# EAGLE schematic collpitss (EAGLE 7.6.0)
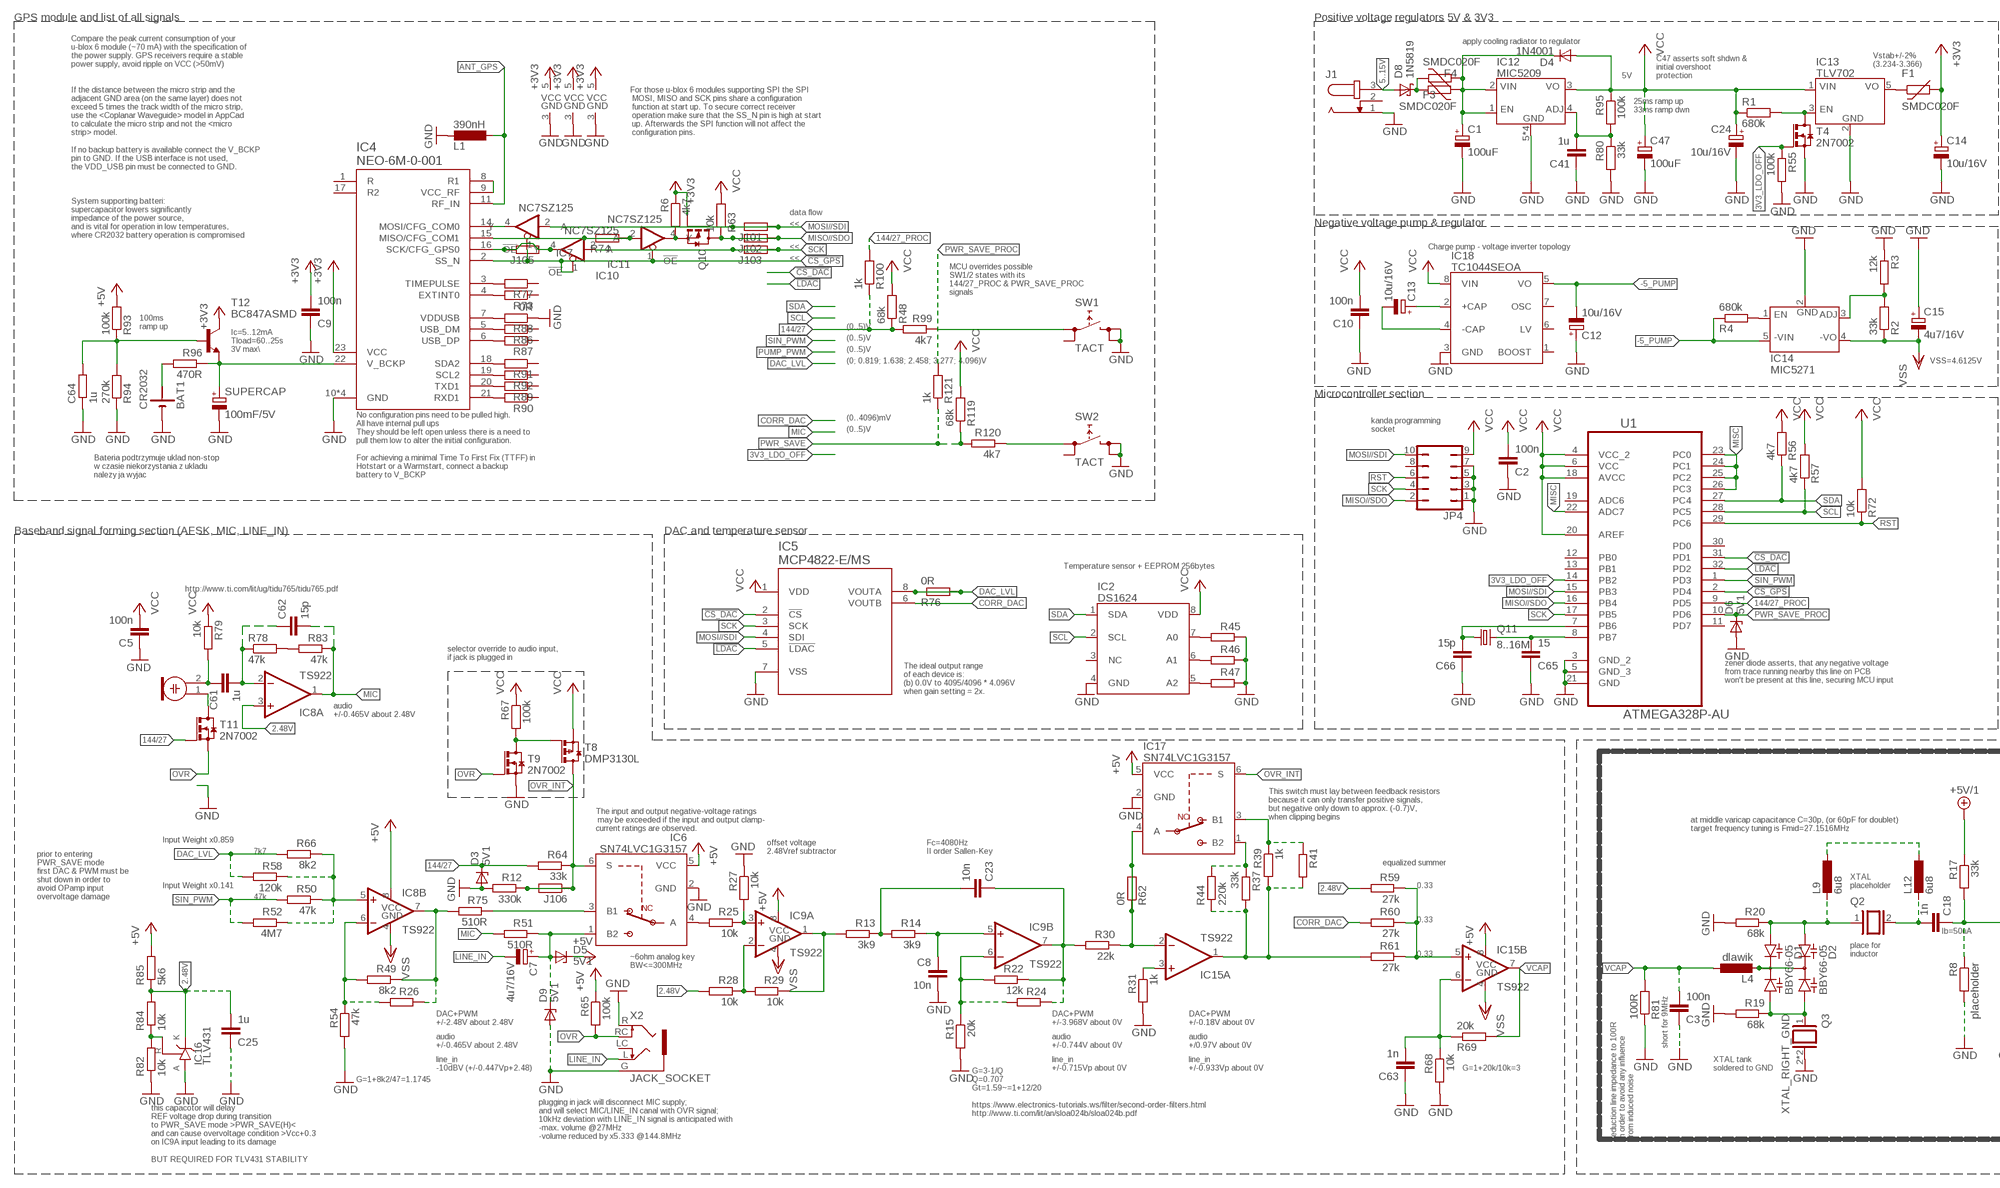
[diagram p0: schematic, sheet 1, part 1 of 2]
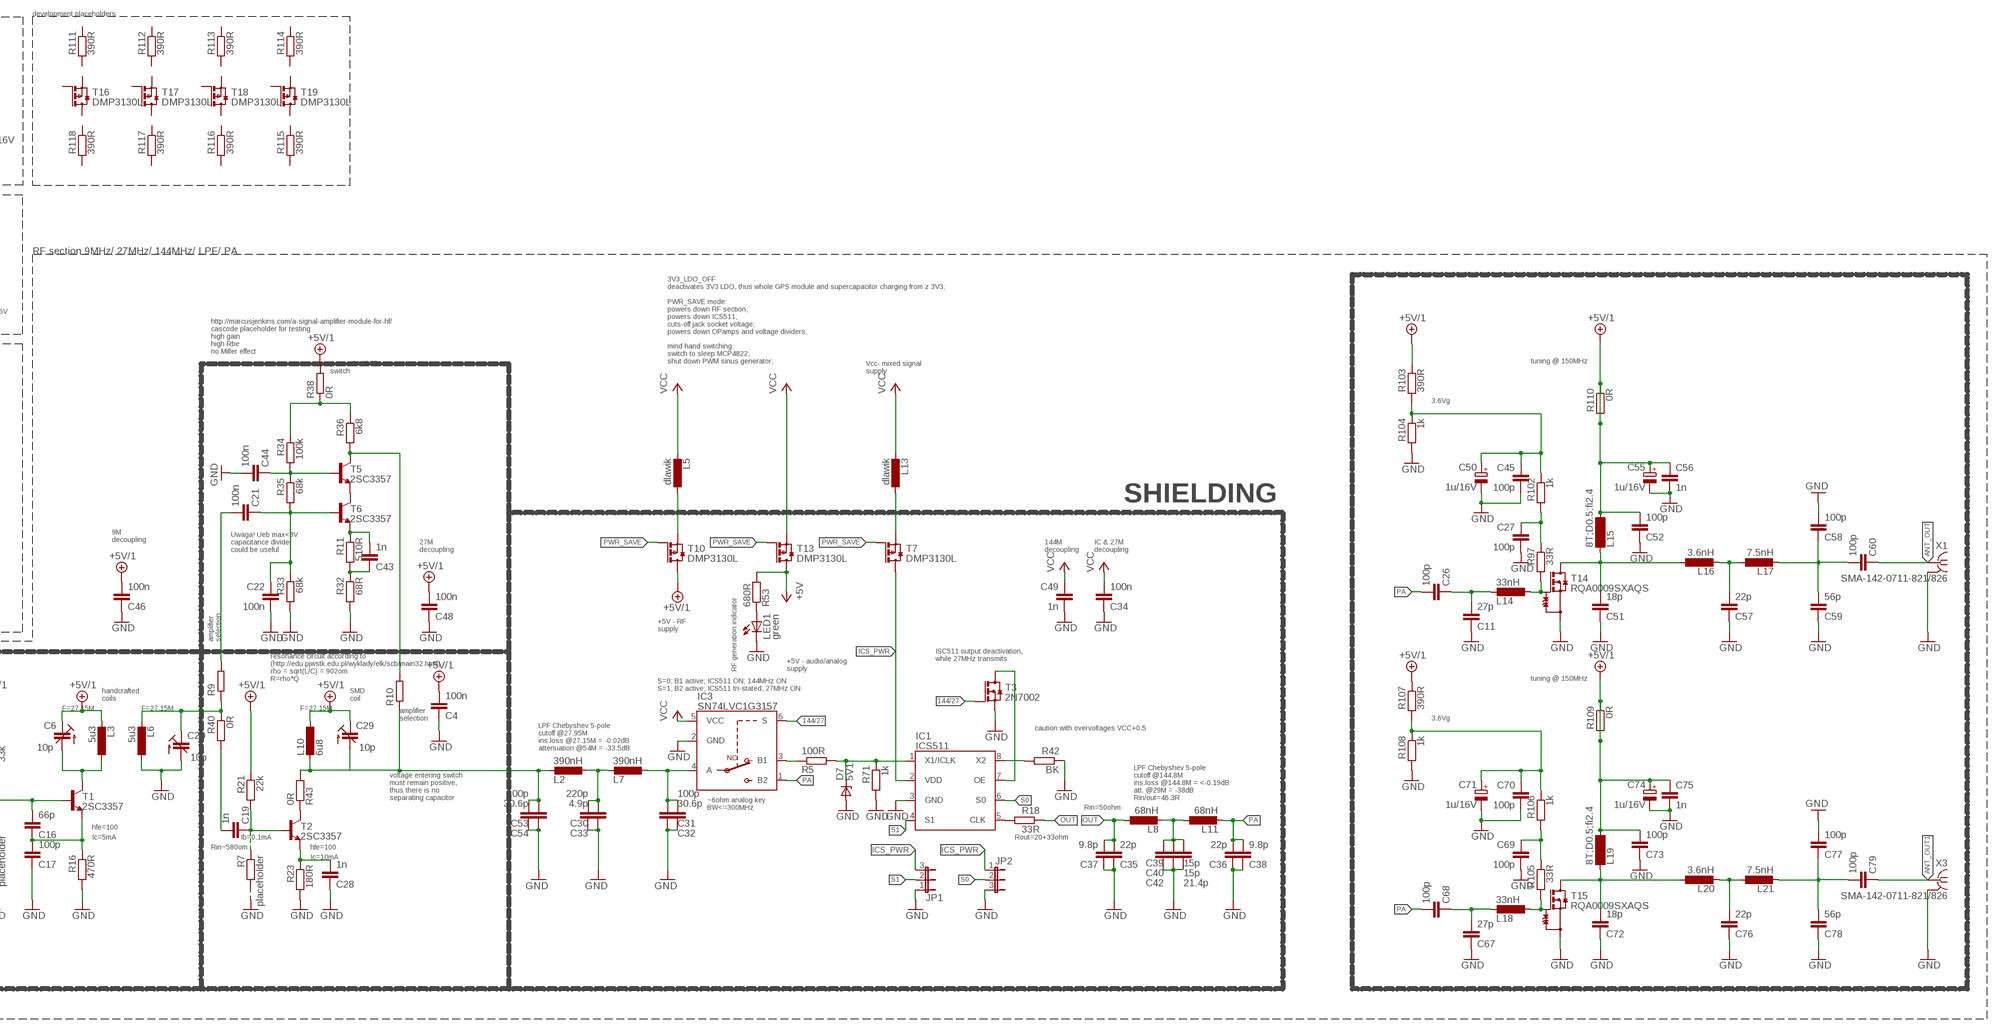
[diagram p1: schematic, sheet 1, part 2 of 2]

## Parts
BAT1  CR2032  [CR2032_HOLDER]
C1  100uF  CPOL-EU153CLV-0605  [153CLV-0605]
C2  100n  C-EUC0805  [C0805]
C3  100n  C-EUC0805  [C0805]
C4  100n  C-EUC0805  [C0805]
C5  100n  C-EUC0805  [C0805]
C6  10p  C_TRIMM  [TZC3_SERIES]
C7  4u7/16V  TANTAL_POLY"3218"  [TANTAL"3216"]
C8  10n  C-EUC0805  [C0805]
C9  100n  C-EUC0805  [C0805]
C10  100n  C-EUC0805  [C0805]
C11  27p  C-EUC0805  [C0805]
C12  10u/16V  TANTAL_POLY"3218"  [TANTAL"3216"]
C13  10u/16V  TANTAL_POLY"3218"  [TANTAL"3216"]
C14  10u/16V  TANTAL_POLY"3218"  [TANTAL"3216"]
C15  4u7/16V  TANTAL_POLY"3218"  [TANTAL"3216"]
C16  66p  C-EUC0805  [C0805]
C17  100p  C-EUC0805  [C0805]
C18  1n  C-EUC0603K  [C0603K]
C19  1n  C-EUC0603K  [C0603K]
C20  10p  C_TRIMM  [TZC3_SERIES]
C21  100n  C-EUC0805  [C0805]
C22  100n  C-EUC0805  [C0805]
C23  10n  C-EUC0805  [C0805]
C24  10u/16V  TANTAL_POLY"3218"  [TANTAL"3216"]
C25  1u  C-EUC1206  [C1206]
C26  100p  C-EUC0805  [C0805]
C27  100p  C-EUC0805  [C0805]
C28  1n  C-EUC0603K  [C0603K]
C29  10p  C_TRIMM  [TZC3_SERIES]
C30  220p  C-EUC0805  [C0805]
C31  100p  C-EUC0805  [C0805]
C32  30.6p  C-EUC0805  [C0805]
C33  4.9p  C-EUC0805  [C0805]
C34  100n  C-EUC0805  [C0805]
C35  22p  C-EUC0805  [C0805]
C36  22p  C-EUC0805  [C0805]
C37  9.8p  C-EUC0805  [C0805]
C38  9.8p  C-EUC0805  [C0805]
C39  15p  C-EUC0805  [C0805]
C40  21.4p  C-EUC0805  [C0805]
C41  1u  C-EUC1206  [C1206]
C42  15p  C-EUC0805  [C0805]
C43  1n  C-EUC0603K  [C0603K]
C44  100n  C-EUC0805  [C0805]
C45  100p  C-EUC0805  [C0805]
C46  100n  C-EUC0805  [C0805]
C47  100uF  CPOL-EU153CLV-0605  [153CLV-0605]
C48  100n  C-EUC0805  [C0805]
C49  1n  C-EUC0603K  [C0603K]
C50  1u/16V  TANTAL_POLY"3218"  [TANTAL"3216"]
C51  18p  C-EUC0805  [C0805]
C52  100p  C-EUC0805  [C0805]
C53  100p  C-EUC0805  [C0805]
C54  30.6p  C-EUC0805  [C0805]
C55  1u/16V  TANTAL_POLY"3218"  [TANTAL"3216"]
C56  1n  C-EUC0603K  [C0603K]
C57  22p  C-EUC0805  [C0805]
C58  100p  C-EUC0805  [C0805]
C59  56p  C-EUC0805  [C0805]
C60  100p  C-EUC0805  [C0805]
C61  1u  ZWORA_C  [ZWORA]
C62  15p  C-EUC0805  [C0805]
C63  1n  C-EUC0603K  [C0603K]
C64  1u  ZWORA  [ZWORA]
C65  15  C-EUC0805  [C0805]
C66  15p  C-EUC0805  [C0805]
C67  27p  C-EUC0805  [C0805]
C68  100p  C-EUC0805  [C0805]
C69  100p  C-EUC0805  [C0805]
C70  100p  C-EUC0805  [C0805]
C71  1u/16V  TANTAL_POLY"3218"  [TANTAL"3216"]
C72  18p  C-EUC0805  [C0805]
C73  100p  C-EUC0805  [C0805]
C74  1u/16V  TANTAL_POLY"3218"  [TANTAL"3216"]
C75  1n  C-EUC0603K  [C0603K]
C76  22p  C-EUC0805  [C0805]
C77  100p  C-EUC0805  [C0805]
C78  56p  C-EUC0805  [C0805]
C79  100p  C-EUC0805  [C0805]
D1  BBY66-05  [SOT23-3]
D2  BBY66-05  [SOT23-3]
D3  5V1  1N4148  [SOD323]
D4  1N4001  [DO-214AC]
D5  5V1  1N4148  [SOD323]
D6  5V1  1N4148  [SOD323]
D7  5V1  1N4148  [SOD323]
D8  1N5819  [DO-214AC]
D9  5V1  1N4148  [SOD323]
F1  SMDC020F  [1812]
F3  SMDC020F  [1812]
F4  SMDC020F  [1812]
IC1  ICS511  [SOIC8]
IC2  DS1624  [SOIC8]
IC3  SN74LVC1G3157  [SC70-6]
IC4  NEO-6M-0-001  [NEO-6M-0-001]
IC5  MCP4822-E/MS  [SOP65P490X110-8N]
IC6  SN74LVC1G3157  [SC70-6]
IC7  NC7SZ125  [SC70-5]
IC8  TS922  [SO08]
IC9  TS922  [SO08]
IC10  NC7SZ125  [SC70-5]
IC11  NC7SZ125  [SC70-5]
IC12  MIC5209  [SOIC8]
IC13  TLV702  [SOT23-5]
IC14  MIC5271  [SOT23-5]
IC15  TS922  [SO08]
IC16  TLV431  TL431-ASA  [SOT23-3]
IC17  SN74LVC1G3157  [SC70-6]
IC18  TC1044SEOA  [SOIC8]
J1  JACK-PLUG1  [SPC4078]
J101  ZWORA  [ZWORA]
J102  ZWORA  [ZWORA]
J103  ZWORA  [ZWORA]
J105  ZWORA  [ZWORA]
J106  ZWORA  [ZWORA]
JP1  JP2E  [JP2]
JP2  JP2E  [JP2]
JP4  JP5Q  [JP5Q]
L1  390nH  0603K_INDUCTOR  [0603K]
L2  390nH  0603K_INDUCTOR  [0603K]
L3  5u3  L-EUL1812  [L1812]
L4  dlawik  0806_INDUCTOR  [0806]
L5  dlawik  0806_INDUCTOR  [0806]
L6  5u3  L-EUL1812  [L1812]
L7  390nH  0603K_INDUCTOR  [0603K]
L8  68nH  0805_INDUCTOR  [0805]
L9  6u8  1812_INDUCTOR  [1812]
L10  6u8  1812_INDUCTOR  [1812]
L11  68nH  0805_INDUCTOR  [0805]
L12  6u8  1812_INDUCTOR  [1812]
L13  dlawik  0806_INDUCTOR  [0806]
L14  33nH  0603K_INDUCTOR  [0603K]
L15  8T;D0.5;fi2.4  SM-Z15  [SM-Z15]
L16  3.6nH  0805_INDUCTOR  [0805]
L17  7.5nH  0805_INDUCTOR  [0805]
L18  33nH  0603K_INDUCTOR  [0603K]
L19  8T;D0.5;fi2.4  SM-Z15  [SM-Z15]
L20  3.6nH  0805_INDUCTOR  [0805]
L21  7.5nH  0805_INDUCTOR  [0805]
LED1  green  LEDCHIP-LED0805  [CHIP-LED0805]
M1  ELECTRET_MICROPHON-WM-61A  [WM-61A]
Q2  XTAL"  [Q"]
Q3  XTAL_RIGHT_GND  [Q]
Q10  AO3402  [SOT23-3]
Q11  8..16M  CRYSTALSM49  [SM49]
R1  680k  ZWORA  [ZWORA]
R2  33k  R-EU_R0805  [R0805]
R3  12k  R-EU_R0805  [R0805]
R4  680k  R-EU_R0805  [R0805]
R5  100R  R-EU_R0805  [R0805]
R6  4k7  R-EU_R0805  [R0805]
R7  placeholder  R-EU_R0805  [R0805]
R8  placeholder  R-EU_R0805  [R0805]
R9  ZWORA  [ZWORA]
R10  ZWORA  [ZWORA]
R11  510R  R-EU_R0805  [R0805]
R12  330k  R-EU_R0805  [R0805]
R13  3k9  R-EU_R0805  [R0805]
R14  3k9  R-EU_R0805  [R0805]
R15  20k  R-EU_R0805  [R0805]
R16  470R  R-EU_R0805  [R0805]
R17  33k  R-EU_R0805  [R0805]
R18  33R  R-EU_R0805  [R0805]
R19  68k  R-EU_R0805  [R0805]
R20  68k  R-EU_R0805  [R0805]
R21  22k  R-EU_R0805  [R0805]
R22  12k  R-EU_R0805  [R0805]
R23  180R  R-EU_R0805  [R0805]
R24  R-EU_R0805  [R0805]
R25  10k  R-EU_R0805  [R0805]
R26  R-EU_R0805  [R0805]
R27  10k  R-EU_R0805  [R0805]
R28  10k  R-EU_R0805  [R0805]
R29  10k  R-EU_R0805  [R0805]
R30  22k  R-EU_R0805  [R0805]
R31  1k  R-EU_R0805  [R0805]
R32  68R  ZWORA  [ZWORA]
R33  68k  R-EU_R0805  [R0805]
R34  100k  R-EU_R0805  [R0805]
R35  68k  R-EU_R0805  [R0805]
R36  6k8  R-EU_R0805  [R0805]
R37  33k  R-EU_R0805  [R0805]
R38  0R  R-EU_R1206  [R1206]
R39  1k  R-EU_R0805  [R0805]
R40  0R  R-EU_R1206  [R1206]
R41  R-EU_R0805  [R0805]
R42  BK  R-EU_R0805  [R0805]
R43  0R  R-EU_R1206  [R1206]
R44  220k  R-EU_R0805  [R0805]
R45  R-EU_R0805  [R0805]
R46  R-EU_R0805  [R0805]
R47  R-EU_R0805  [R0805]
R48  68k  R-EU_R0805  [R0805]
R49  8k2  R-EU_R0805  [R0805]
R50  47k  R-EU_R0805  [R0805]
R51  510R  R-EU_R0805  [R0805]
R52  4M7  R-EU_R0805  [R0805]
R53  680R  ZWORA  [ZWORA]
R54  47k  R-EU_R0805  [R0805]
R55  100k  R-EU_R0805  [R0805]
R56  4k7  R-EU_R0805  [R0805]
R57  4k7  ZWORA  [ZWORA]
R58  120k  R-EU_R0805  [R0805]
R59  27k  R-EU_R0805  [R0805]
R60  27k  R-EU_R0805  [R0805]
R61  27k  R-EU_R0805  [R0805]
R62  0R  ZWORA  [ZWORA]
R63  10k  R-EU_R0805  [R0805]
R64  33k  R-EU_R0805  [R0805]
R65  100k  ZWORA  [ZWORA]
R66  8k2  R-EU_R0805  [R0805]
R67  100k  R-EU_R0805  [R0805]
R68  10k  R-EU_R0805  [R0805]
R69  20k  R-EU_R0805  [R0805]
R71  1k  R-EU_R0805  [R0805]
R72  10k  R-EU_R0805  [R0805]
R73  R-EU_R0805  [R0805]
R74  ZWORA  [ZWORA]
R75  510R  R-EU_R0805  [R0805]
R76  0R  ZWORA  [ZWORA]
R77  R-EU_R0805  [R0805]
R78  47k  R-EU_R0805  [R0805]
R79  10k  R-EU_R0805  [R0805]
R80  33k  R-EU_R0805  [R0805]
R81  100R  R-EU_R0805  [R0805]
R82  10k  R-EU_R0805  [R0805]
R83  47k  R-EU_R0805  [R0805]
R84  10k  R-EU_R0805  [R0805]
R85  5k6  R-EU_R0805  [R0805]
R86  R-EU_R0805  [R0805]
R87  R-EU_R0805  [R0805]
R88  0R  R-EU_R0805  [R0805]
R89  R-EU_R0805  [R0805]
R90  R-EU_R0805  [R0805]
R91  R-EU_R0805  [R0805]
R92  R-EU_R0805  [R0805]
R93  100k  R-EU_R0805  [R0805]
R94  270k  ZWORA  [ZWORA]
R95  100k  R-EU_R0805  [R0805]
R96  470R  ZWORA  [ZWORA]
R97  33R  R-EU_R0805  [R0805]
R99  4k7  R-EU_R0805  [R0805]
R100  1k  R-EU_R0805  [R0805]
R102  1k  R-EU_R0805  [R0805]
R103  390R  R-EU_R0805  [R0805]
R104  1k  R-EU_R0805  [R0805]
R105  33R  R-EU_R0805  [R0805]
R106  1k  R-EU_R0805  [R0805]
R107  390R  R-EU_R0805  [R0805]
R108  1k  R-EU_R0805  [R0805]
R109  0R  ZWORA  [ZWORA]
R110  0R  ZWORA  [ZWORA]
R111  390R  R-EU_R0805  [R0805]
R112  390R  R-EU_R0805  [R0805]
R113  390R  R-EU_R0805  [R0805]
R114  390R  R-EU_R0805  [R0805]
R115  390R  R-EU_R0805  [R0805]
R116  390R  R-EU_R0805  [R0805]
R117  390R  R-EU_R0805  [R0805]
R118  390R  R-EU_R0805  [R0805]
R119  68k  R-EU_R0805  [R0805]
R120  4k7  R-EU_R0805  [R0805]
R121  1k  ZWORA  [ZWORA]
SUPERCAP  100mF/5V  CPOL-EUUD-10X10  [UD-10X10_NICHICON]
SW1  TACT  [TACT]
SW2  TACT  [TACT]
T1  2SC3357  [SOT-89-BCE]
T2  2SC3357  [SOT-89-BCE]
T3  2N7002  [SOT23-3W]
T4  2N7002  [SOT23-3W]
T5  2SC3357  [SOT-89-BCE]
T6  2SC3357  [SOT-89-BCE]
T7  DMP3130L  [SOT23-3]
T8  DMP3130L  [SOT23-3]
T9  2N7002  [SOT23-3W]
T10  DMP3130L  [SOT23-3]
T11  2N7002  [SOT23-3W]
T12  BC847ASMD  [SOT23]
T13  DMP3130L  [SOT23-3]
T14  RQA0009SXAQS  [SOT-89-GSD]
T15  RQA0009SXAQS  [SOT-89-GSD]
T16  DMP3130L  [SOT23-3]
T17  DMP3130L  [SOT23-3]
T18  DMP3130L  [SOT23-3]
T19  DMP3130L  [SOT23-3]
U1  ATMEGA328P-AU  [QFP80P900X900X120-32N]
X1  SMA-142-0711-821/826  [J502-ND-142-0711-821/826]
X2  JACK_SOCKET  [JACK_SOCKET]
X3  SMA-142-0711-821/826  [J502-ND-142-0711-821/826]

## Nets
2.48V: C25.2 IC8.3(A:+IN) IC16.2(K) R28.2 R59.2 R84.2 R85.1
3V3_LDO_OFF: R55.1 T4.1(G) U1.14(PB2)
5..15V: D8.A J1.3
144/27: D3.C(K) IC3.6(S) R48.1 R64.2 R99.2 R100.1 T3.1(G) T11.1(G)
144/27_PROC: R100.2 U1.9(PD5)
!CS_DAC!: IC5.2(!CS!) U1.31(PD1)
!CS_GPS!: IC4.2(SS_N) IC7.1(!OE!) IC10.1(!OE!) IC11.1(!OE!) U1.2(PD4)
!LDAC!: IC5.5(!LDAC!) U1.32(PD2)
+3V3: C9.2 C14.+ F1.P$2 IC4.23(VCC) IC7.5(VCC) IC10.5(VCC) IC11.5(VCC) Q10.1(G) R6.1 T12.3(C)
+5V: D5.C(K) IC6.5(VCC) IC8.8(C:VCC) IC9.8(C:VCC) IC15.8(C:VCC) IC17.5(VCC) R53.2 R65.1 R85.2 R93.2 T13.3(D)
+5V/1: C4.2 C6.2(E) C29.2(E) C46.2 C48.2 C52.2 C55.+ C56.1 C73.2 C74.+ C75.1 L3.2 L10.1 L15.2 L19.2 R17.1 R21.1 R38.2 R103.1 R107.1 R109.1 R109.2 R110.1 R110.2 T10.3(D)
-5_PUMP: C12.- IC14.5(-VIN) IC18.5(VO) R4.1
ANT_GPS: IC4.11(RF_IN) L1.1
ANT_OUT: C60.1 X1.1
ANT_OUT1: C79.1 X3.1
ASASA: D8.C(K) F3.P$1 F4.P$2
CAS_IN: C20.2(E) L6.2 R9.1 R40.1
CORR_DAC: IC5.6(VOUTB) R60.2
DAC_LVL: IC5.8(VOUTA) R58.2 R66.2 R76.1 R76.2
GND: BAT1.- C1.- C2.1 C3.1 C4.1 C5.1 C8.2 C9.1 C10.1 C11.1 C12.+ C14.- C15.+ C17.1 C20.1(A) C22.2 C24.- C25.1 C27.2 C28.1 C30.1 C31.1 C32.1 C33.1 C34.1 C35.1 C36.1 C37.1 C38.1 C39.1 C40.1 C41.1 C42.1 C44.2 C45.2 C46.1 C47.- C48.1 C49.2 C50.- C51.1 C52.1 C53.1 C54.1 C55.- C56.2 C57.1 C58.2 C59.1 C63.1 C64.1 C65.1 C66.1 C67.1 C69.2 C70.2 C71.- C72.1 C73.1 C74.- C75.2 C76.1 C77.2 C78.1 D3.A D6.A D7.A D9.A IC1.3(GND) IC2.4(GND) IC3.2(GND) IC4.10(GND) IC4.12(GND) IC4.13(GND) IC4.24(GND) IC5.7(VSS) IC6.2(GND) IC7.3(GND) IC10.3(GND) IC11.3(GND) IC12.5(GND) IC12.6(GND) IC12.7(GND) IC12.8(GND) IC13.2(GND) IC14.2(GND) IC16.3(A) IC17.2(GND) IC18.3(GND) J1.1 JP1.1 JP2.3 JP4.1 JP4.3 JP4.5 JP4.7 L1.2 L6.1 LED1.C Q3.2 Q3.P$1 R3.1 R7.2 R8.2 R12.2 R15.2 R16.2 R19.2 R20.2 R23.2 R27.1 R31.2 R32.2 R33.2 R42.1 R45.1 R46.1 R47.1 R54.2 R55.2 R68.2 R71.2 R80.2 R81.1 R82.1 R88.1 R94.1 R104.2 R108.2 SUPERCAP.- SW1.2 SW1.3 SW2.2 SW2.3 T3.2(S) T4.2(S) T9.2(S) T14.2(S) T14.2@1(S) T15.2(S) T15.2@1(S) U1.3(GND_2) U1.5(GND_3) U1.21(GND) X1.G@1 X1.G@2 X1.G@3 X1.G@4 X2.G(GND) X2.R X3.G@1 X3.G@2 X3.G@3 X3.G@4
ICS_PWR: IC1.2(VDD) JP1.3 JP2.1 T7.3(D)
J104: IC4.15(MISO/CFG_COM1) IC11.2(A) R74.1 R74.2
LINE_IN: C7.- X2.L
LOLOLO: IC13.3(EN) R1.2 T4.3(D)
MIC: C62.2 IC8.1(A:OUT) R51.2 R83.1
MISC: U1.22(ADC7) U1.23(PC0) U1.24(PC1) U1.25(PC2) U1.26(PC3)
MISO//SDO: J102.1 J102.2 JP4.2 Q10.3(D) R63.1 U1.16(PB4)
MOSI//SDI: IC5.4(SDI) IC7.2(A) J101.1 J101.2 JP4.10 U1.15(PB3)
N$1: C31.2 C32.2 IC3.4(A) L7.1
N$2: D1.3(K) D2.3(K) L4.2
N$3: C1.+ D4.C(K) F3.P$2 F4.P$1 IC12.1(EN) IC12.2(VIN)
N$4: F1.P$1 IC13.5(VO)
N$5: BAT1.+ R96.2
N$6: IC14.3(ADJ) R2.2 R3.2
N$7: C6.1(A) L3.1 T1.C T1.C@1(C)
N$8: IC3.3(B1) R5.1
N$9: L5.1 T10.2(S)
N$10: IC1.7(OE) T3.3(D)
N$11: IC14.1(EN) R4.2
N$12: C23.2 R13.1 R14.2
N$13: D1.2(A2) D2.2(A2) Q3.1 R19.1
N$14: IC11.4(Y) Q10.2(S) R6.2
N$15: D1.1(A1) D2.1(A1) L9.2 Q2.1 R20.1
N$16: C18.2 L12.2 Q2.2
N$17: L9.1 L12.1
N$19: C16.2 C18.1 R8.1 R17.2 T1.B
N$20: C29.1(A) C53.2 C54.2 L2.2 L10.2 R10.1 R43.2
N$21: C23.1 IC9.7(B:OUT) R22.1 R24.1 R30.2
N$22: C8.1 IC9.5(B:+IN) R14.1
N$23: IC9.6(B:-IN) R15.1 R22.2 R24.2
N$24: C28.2 R23.1 T2.E
N$25: IC6.4(A) R25.2
N$26: C19.1 R7.1 R21.2 T2.B
N$27: IC9.3(A:+IN) R25.1 R27.2
N$28: IC9.2(A:-IN) R28.1 R29.2
N$29: IC15.3(A:+IN) R31.1
N$30: IC9.1(A:OUT) R13.2 R29.1
N$31: IC17.3(B1) R39.1 R41.1
N$32: IC15.1(A:OUT) R37.2 R39.2 R41.2 R44.1 R61.2
N$33: C16.1 C17.2 R16.1 T1.E
N$34: IC17.1(B2) R37.1 R44.2
N$35: R99.1 SW1.1
N$36: L13.1 T7.2(S)
N$37: IC15.2(A:-IN) IC17.4(A) R30.1 R62.1 R62.2
N$38: C13.+ IC18.2(+CAP)
N$39: C11.2 C26.1 L14.2
N$40: C13.- IC18.4(-CAP)
N$41: C27.1 R97.1 R102.2
N$42: C21.2 R9.2
N$43: C67.2 C68.1 L18.2
N$44: L18.1 R105.2 T15.1(G)
N$45: L14.1 R97.2 T14.1(G)
N$46: C51.2 L15.1 L16.1 T14.3(D)
N$47: C57.2 L16.2 L17.1
N$48: C69.1 R105.1 R106.2
N$49: T5.E T6.C T6.C@1(C)
N$50: C43.2 R11.1 T6.E
N$51: C43.1 R11.2 R32.1
N$52: C44.1 R34.2 R35.1 T5.B
N$53: C39.2 C40.2 C42.2 L8.2 L11.1
N$54: C58.1 C59.2 C60.2 L17.2
N$55: C19.2 R40.2
N$56: C21.1 C22.1 R33.1 R35.2 T6.B
N$57: R10.2 R36.2 T5.C T5.C@1(C)
N$58: R34.1 R36.1 R38.1
N$59: IC1.5(CLK) R18.2
N$60: R43.1 T2.C T2.C@1(C)
N$61: IC1.8(X2) R42.2
N$62: C72.2 L19.1 L20.1 T15.3(D)
N$63: C41.2 IC12.4(ADJ) R80.1 R95.2
N$64: R67.2 T8.1(G) T9.3(D)
N$65: C45.1 C50.+ R102.1 R103.2 R104.1
N$66: IC2.7(A0) R45.2
N$67: IC2.6(A1) R46.2
N$68: IC2.5(A2) R47.2
N$69: C76.2 L20.2 L21.1
N$70: IC8.7(B:OUT) R26.1 R49.1 R75.2
N$71: C7.+ D5.A D9.C(K) IC6.1(B2) R51.1
N$72: D7.C(K) IC1.1(X1/ICLK) R5.2 R71.1
N$73: C77.1 C78.2 C79.2 L21.2
N$74: C30.2 C33.2 L2.1 L7.2
N$75: C70.1 C71.+ R106.1 R107.2 R108.1
N$76: IC8.5(B:+IN) R50.1 R52.1 R58.1 R66.1
N$79: R120.1 SW2.1
N$80: IC4.22(V_BCKP) R96.1 SUPERCAP.+ T12.2(E)
N$83: IC4.4(EXTINT0) R73.2
N$85: C63.2 IC15.6(B:-IN) R68.1 R69.1
N$87: IC15.5(B:+IN) R59.1 R60.1 R61.1
N$88: IC4.3(TIMEPULSE) R77.2
N$89: C61.1 M1.2 R79.2
N$90: IC6.3(B1) R75.1
N$91: R78.2 R83.2
N$92: IC4.14(MOSI/CFG_COM0) IC7.4(Y)
N$93: IC4.16(SCK/CFG_GPS0) IC10.4(Y) J105.1 J105.2
N$95: C61.2 C62.1 IC8.2(A:-IN) R78.1
N$96: LED1.A R53.1
N$97: IC8.6(B:-IN) R26.2 R49.2 R54.1
N$98: IC16.1(R) R82.2 R84.1
N$99: IC4.5(USB_DM) R86.2
N$100: IC4.6(USB_DP) R87.2
N$101: IC4.7(VDDUSB) R88.2
N$102: IC4.20(TXD1) R89.2
N$103: IC4.21(RXD1) R90.2
N$104: IC4.18(SDA2) R91.2
N$105: IC4.19(SCL2) R92.2
N$107: IC4.8(R1) IC4.9(VCC_RF)
N$108: C65.2 Q11.2 U1.8(PB7)
N$109: C64.2 R93.1 R94.2 T12.1(B)
N$113: C66.2 Q11.1 U1.7(PB6)
N$114: M1.1 T11.3(D)
OUT: C35.2 C37.2 L8.1 R18.1
OVR: R65.2 T9.1(G) T11.2(S) X2.RC
OVR_INT: IC6.6(S) IC17.6(S) J106.1 J106.2 R12.1 R64.1 T8.3(D)
PA: C26.2 C36.2 C38.2 C68.2 IC3.1(B2) L11.2
PWR_SAVE: R119.1 R120.2 R121.1 T7.1(G) T10.1(G) T13.1(G)
PWR_SAVE_PROC: D6.C(K) R121.2 U1.10(PD6)
RST: JP4.6 R72.1 U1.29(PC6)
S0: IC1.6(S0) JP2.2
S1: IC1.4(S1) JP1.2
SCK: IC5.3(SCK) IC10.2(A) J103.1 J103.2 JP4.4 U1.17(PB5)
SCL: IC2.2(SCL) R57.1 U1.28(PC5)
SDA: IC2.1(SDA) R56.1 U1.27(PC4)
SIN_PWM: R50.2 R52.2 U1.1(PD3)
VCAP: C3.2 IC15.7(B:OUT) L4.1 R69.2 R81.2
VCC: C2.2 C5.2 C10.2 C24.+ C34.2 C47.+ C49.1 D4.A IC2.8(VDD) IC3.5(VCC) IC5.1(VDD) IC12.3(VO) IC13.1(VIN) IC18.8(VIN) JP4.9 L5.2 L13.2 R1.1 R48.2 R56.2 R57.2 R63.2 R67.1 R72.2 R79.1 R95.1 R119.2 T8.2(S) T13.2(S) U1.4(VCC_2) U1.6(VCC) U1.18(AVCC) U1.20(AREF)
VSS: C15.- IC8.4(C:GND) IC9.4(C:GND) IC14.4(-VO) IC15.4(C:GND) R2.1
Unconnected: IC2.3(NC) IC4.1(R) IC4.17(R2) IC18.1(BOOST) IC18.6(LV) IC18.7(OSC) J1.2 JP4.8 R73.1 R77.1 R86.1 R87.1 R89.1 R90.1 R91.1 R92.1 R111.1 R111.2 R112.1 R112.2 R113.1 R113.2 R114.1 R114.2 R115.1 R115.2 R116.1 R116.2 R117.1 R117.2 R118.1 R118.2 SW1.4 SW2.4 T16.1(G) T16.2(S) T16.3(D) T17.1(G) T17.2(S) T17.3(D) T18.1(G) T18.2(S) T18.3(D) T19.1(G) T19.2(S) T19.3(D) U1.11(PD7) U1.12(PB0) U1.13(PB1) U1.19(ADC6) U1.30(PD0) X2.LC

## Notes on the sheet
- GPS module and list of all signals | Positive voltage regulators 5V & 3V3 | development placeholders
- apply cooling radiator to regulator
- Compare the peak current consumption of your 
  u-blox 6 module (~70 mA) with the specification of
  the power supply. GPS receivers require a stable
  power supply, avoid ripple on VCC (>50mV)
- Vstab+/-2%
  (3.234-3.366)
- 5V
- C47 asserts soft shdwn &
  initial overshoot
  protection
- 25ms ramp up
  33ms ramp dwn
- If the distance between the micro strip and the
  adjacent GND area (on the same layer) does not
  exceed 5 times the track width of the micro strip,
  use the <Coplanar Waveguide> model in AppCad
  to calculate the micro strip and not the <micro
  strip> model.
- For those u-blox 6 modules supporting SPI the SPI
   MOSI, MISO and SCK pins share a configuration
   function at start up. To secure correct receiver
   operation make sure that the SS_N pin is high at start
   up. Afterwards the SPI function will not affect the
   configuration pins.
- If no backup battery is available connect the V_BCKP
  pin to GND. If the USB interface is not used, 
  the VDD_USB pin must be connected to GND.
- data flow
- << | Negative voltage pump & regulator
- System supporting batteri:
  supercapacitor lowers significantly 
  impedance of the power source, 
  and is vital for operation in low temperatures, 
  where CR2032 battery operation is compromised
- << | Charge pump - voltage inverter topology
- <<
- MCU overrides possible 
  SW1/2 states with its
  144/27_PROC & PWR_SAVE_PROC
  signals
- RF section 9MHz/ 27MHz/ 144MHz/ LPF/ PA
- 100ms 
  ramp up
- (0..5)V
- (0..5)V
- Ic=5..12mA
  Tload=60..25s
  3V max\
- (0..5)V
- (0; 0.819; 1.638; 2.458; 3.277; 4.096)V | VSS=4.6125V
- Microcontroller section
- http://marcusjenkins.com/a-signal-amplifier-module-for-hf/
  cascode placeholder for testing
  high gain
  high Rbe
  no Miller effect
- (0..4096)mV
- 3V3_LDO_OFF
  deactivates 3V3 LDO, thus whole GPS module and supercapacitor charging from z 3V3;
  
  PWR_SAVE mode:
  powers down RF section;
  powers down ICS511;
  cuts-off jack socket voltage;
  powers down OPamps and voltage dividers;
  
  mind hand switching:
  switch to sleep MCP4822;
  shut down PWM sinus generator;
- tuning @ 150MHz
- (0..5)V
- kanda programming
  socket
- power ON/OFF
  switch
- Vcc- mixed signal 
  supply
- No configuration pins need to be pulled high. 
  All have internal pull ups
  They should be left open unless there is a need to 
  pull them low to alter the initial configuration.
- 3.6Vg
- Bateria podtrzymuje uklad non-stop
  w czasie niekorzystania z ukladu
  nalezy ja wyjac
- For achieving a minimal Time To First Fix (TTFF) in
  Hotstart or a Warmstart, connect a backup
  battery to V_BCKP
- Baseband signal forming section (AFSK, MIC, LINE_IN) | DAC and temperature sensor
- Temperature sensor + EEPROM 256bytes
- SHIELDING
- http://www.ti.com/lit/ug/tidu765/tidu765.pdf
- 9M
  decoupling
- Uwaga! Ueb max<3V
  capacitance divider
  could be useful
- 27M
  decoupling
- 144M 
  decoupling
- IC & 27M
  decoupling
- selector override to audio input,
  if jack is plugged in
- zener diode asserts, that any negative voltage
  from trace running nearby this line on PCB
  won't be present at this line, securing MCU input
- The ideal output range 
  of each device is:
  (b) 0.0V to 4095/4096 * 4.096V 
  when gain setting = 2x.
- audio
  +/-0.465V about 2.48V
- +5V - RF 
  supply
- amplifier
  selection
- ISC511 output deactivation,
  while 27MHz transmits
- RF generation indicator
- +5V - audio/analog 
  supply
- resonance circuit according to
  (http://edu.pjwstk.edu.pl/wyklady/elk/scb/main32.html)
  rho = sqrt(L/C) = 902om
  R=rho*Q
- tuning @ 150MHz
- S=0; B1 active; ICS511 ON; 144MHz ON
  S=1; B2 active; ICS511 tri-stated; 27MHz ON
- handcrafted
  coils
- SMD
  coil
- This switch must lay between feedback resistors
  because it can only transfer positive signals,
  but negative only down to approx. (-0.7)V,
  when clipping begins
- F=27.15M | F=27.15M | F=27.15M
- The input and output negative-voltage ratings
   may be exceeded if the input and output clamp-
  current ratings are observed.
- at middle varicap capacitance C=30p, (or 60pF for doublet)
  target frequency tuning is Fmid=27.1516MHz
- amplifier
  selection
- 3.6Vg
- Input Weight x0.859 | caution with overvoltages VCC+0.5
- 7k7
- offset voltage 
  2.48Vref subtractor
- Fc=4080Hz
  II order Sallen-Key
- equalized summer
- LPF Chebyshev 5-pole
  cutoff @27.95M 
  ins.loss @27.15M = -0.02dB
  attenuation @54M = -33.5dB
- Input Weight x0.141 | 0.33
- XTAL
  placeholder
- prior to entering
  PWR_SAVE mode
  first DAC & PWM must be
  shut down in order to
  avoid OPamp input 
  overvoltage damage
- 47k
- 0.33
- voltage entering switch 
  must remain positive,
  thus there is no 
  separating capacitor
- LPF Chebyshev 5-pole
  cutoff @144.8M
  ins.loss @144.8M = <-0.19dB
  att. @29M = -38dB
  Rin/out=46.3R
- Ib=50uA
- ~6ohm analog key 
  BW<=300MHz
- Rin=50ohm
- 0.33
- place for 
  inductor
- hfe=100
- ~6ohm analog key 
  BW<=300MHz
- Ic=5mA | Ib=0.1mA | Rout=20+33ohm
- Rin~580om | hfe=100
- Ic=10mA
- DAC+PWM
  +/-2.48V about 2.48V
- DAC+PWM
  +/-3.968V about 0V
- DAC+PWM
  +/-0.18V about 0V
- audio
  +/-0.465V about 2.48V
- audio
  +/-0.744V about 0V
- audio
  +/0.97V about 0V
- short for 9MHz
- line_in
  -10dBV (+/-0.447Vp+2.48)
- line_in
  +/-0.715Vp about 0V
- line_in
  +/-0.933Vp about 0V
- G=1+20k/10k=3
- XTAL tank
  soldered to GND
- G=1+8k2/47=1.1745
- G=3-1/Q
  Q=0.707
  Gt=1.59~=1+12/20
  
  https://www.electronics-tutorials.ws/filter/second-order-filters.html
  http://www.ti.com/lit/an/sloa024b/sloa024b.pdf
- plugging in jack will disconnect MIC supply;
  and will select MIC/LINE_IN canal with OVR signal;
  10kHz deviation with LINE_IN signal is anticipated with
  -max. volume @27MHz
  -volume reduced by x5.333 @144.8MHz
- reduction line impedance to 100R
  in order to avoid any influence
  from induced noise
- this capacotor will delay
  REF voltage drop during transition
  to PWR_SAVE mode >PWR_SAVE(H)<
  and can cause overvoltage condition >Vcc+0.3
  on IC9A input leading to its damage
  
  BUT REQUIRED FOR TLV431 STABILITY

## Library data of the parts
BAT1 = TI:CR2032: CR2032 +3V springy button battery holder
C1 C47 SUPERCAP = rcl:CPOL-EU: POLARIZED CAPACITOR, European symbol
C2-C5 C8-C11 C16-C19 C21-C23 C25-C28 C30-C46 C48 C49 C51-C54 C56-C60 C62 C63 C65-C70 C72 C73 C75-C79 = rcl:C-EU: CAPACITOR, European symbol
C6 C20 C29 = TI:C_TRIMM: MuRata capacitor trimmer 3-20pF
C7 C12-C15 C24 C50 C55 C71 C74 = TI:TANTAL_POLY"3218": Yellow aliexpress tantal/polymer capacitor 4u7/16V; 10u/16V
C61 = freescale_sensors:ZWORA_C
C64 J101-J103 J105 J106 R1 R9 R10 R32 R53 R57 R62 R65 R74 R76 R94 R96 R109 R110 R121 = freescale_sensors:ZWORA: ZWORKA SMD
D1 D2 = TI:BBY66-05: Silicon Tuning Diodes • High capacitance ratio • High Q hyperabrupt tuning diode • Low series resistance • Designed for low tuning voltage operation for VCO's in mobile communications equipment • Very low capacitance spread
D3 D5-D7 D9 = TI:1N4148
D4 = TI:1N4001: M2 // rectifier diode Vblock = 50V
D8 = TI:1N5819: schottky diode SMD
F1 F3 F4 = PolyFuse:SMDC020F: Polymeric Positive Coefficient Thermistor (PolyFuse) 0.2A / 30V
IC1 = TI:ICS511: The ICS511 LOCOTM is the most cost effective way to generate a high quality, high frequency clock output from a lower frequency crystal or clock input.
IC2 = TI:DS1624: Digital Thermometer and 256 bytes E2 Memory
IC3 IC6 IC17 = TI:SN74LVC1G3157: Single-Pole Double-Throw Analog Switch
IC4 = TI:NEO-6M-0-001: The u-blox 6 leadless chip carrier (LCC) modules are standalone GPS and GPS/GLONASS/QZSS1 modules featuring the high performance u-blox-6 positioning engine.
IC5 = Microchip_By_element14_Batch_1:MCP4822-E/MS: Digital-to-Analog Converter; MPN: MCP4822-E/MS; OC_FARNELL: 1840942; OC_NEWARK: 31K2973; PACKAGE: SOP-8; SUPPLIER: Microchip
IC7 IC10 IC11 = TI:NC7SZ125: 3-state non inverting buffer
IC8 IC9 IC15 = linear:TS922: TS922 and TS922A devices are rail-to-rail dual BiCMOS operational amplifiers optimized and fully specified for 3 V and 5 V operation. These devices have high output currents which allow low-load impedances to be driven. Very low noise, low distortion
IC12 = TI:MIC5209: MIC5209 Microchip extremely LDO 300mA linear regulator
IC13 = TI:TLV702: TLV701-3V3 is a LDO 3V3 linear voltage regulator 320mA 250mV drop
IC14 = TI:MIC5271: Negative voltage LDO regulator with adjustable voltage 600mV drop @ 100mA output; -15Vmax at input
IC16 = TI:TL431-ASA: Reference voltage source with ultra low current (100uA) Vref=1.24 typ.
IC18 = TI:TC1044SEOA: Charge pump DC-DC converter, doubler, inverter 20mA, 1.5-12Vin
J1 = con-jack:JACK-PLUG: DC POWER JACK Power Jack, DC, Right Angle, Through Hole, Rated 5A at 16VDC, PC Terminals Distributor: Farnell (www.Farnell.de) Drawing: 84N1161.pdf / 84N1162.pdf Manufacturer: SPC Technology (www.spctechnology.com) Type: SPC4077 / SPC 4078; OC_FARNELL: unknown; OC_NEWARK: unknown
JP1 JP2 = jumper:JP2E: JUMPER
JP4 = jumper:JP5Q: JUMPER
L1 L2 L7 L14 L18 = TI:0603K_INDUCTOR
L3 L6 = rcl:L-EU: INDUCTOR, European symbol
L4 L5 L13 = TI:0806_INDUCTOR
L8 L11 L16 L17 L20 L21 = TI:0805_INDUCTOR
L9 L10 L12 = TI:1812_INDUCTOR
L15 L19 = inductor-neosid:SM-Z15: INDUCTOR SMD rod core choke; OC_FARNELL: unknown; OC_NEWARK: unknown
LED1 = led:LED: LED OSRAM: - CHIPLED LG R971, LG N971, LY N971, LG Q971, LY Q971, LO R971, LY R971 LH N974, LH R974 LS Q976, LO Q976, LY Q976 LO Q996 - Hyper CHIPLED LW Q18S LB Q993, LB Q99A, LB R99A - SideLED LS A670, LO A670, LY A670, LG A670, LP A670 LB A673, LV A673, LT A673, LW A673 LH A674 LY A675 LS A676, LA A676, LO A676, LY A676, LW A676 LS A679, LY A679, LG A679 - Hyper Micro SIDELED® LS Y876, LA Y876, LO Y876, LY Y876 LT Y87S - SmartLED LW L88C, LW L88S LB L89C, LB L89S, LG L890 LS L89K, LO L89K, LY L89K LS L896, LA L896, LO L896, LY L896 - TOPLED LS T670, LO T670, LY T670, LG T670, LP T670 LSG T670, LSP T670, LSY T670, LOP T670, LYG T670 LG T671, LOG T671, LSG T671 LB T673, LV T673, LT T673, LW T673 LH T674 LS T676, LA T676, LO T676, LY T676, LB T676, LH T676, LSB T676, LW T676 LB T67C, LV T67C, LT T67C, LS T67K, LO T67K, LY T67K, LW E67C LS E67B, LA E67B, LO E67B, LY E67B, LB E67C, LV E67C, LT E67C LW T67C LS T679, LY T679, LG T679 LS T770, LO T770, LY T770, LG T770, LP T770 LB T773, LV T773, LT T773, LW T773 LH T774 LS E675, LA E675, LY E675, LS T675 LS T776, LA T776, LO T776, LY T776, LB T776 LHGB T686 LT T68C, LB T68C - Hyper Mini TOPLED® LB M676 - Mini TOPLED Santana® LG M470 LS M47K, LO M47K, LY M47K Source: http://www.osram.convergy.de LUXEON: - LUMILED® LXK2-PW12-R00, LXK2-PW12-S00, LXK2-PW14-U00, LXK2-PW14-V00 LXK2-PM12-R00, LXK2-PM12-S00, LXK2-PM14-U00 LXK2-PE12-Q00, LXK2-PE12-R00, LXK2-PE12-S00, LXK2-PE14-T00, LXK2-PE14-U00 LXK2-PB12-K00, LXK2-PB12-L00, LXK2-PB12-M00, LXK2-PB14-N00, LXK2-PB14-P00, LXK2-PB14-Q00 LXK2-PR12-L00, LXK2-PR12-M00, LXK2-PR14-Q00, LXK2-PR14-R00 LXK2-PD12-Q00, LXK2-PD12-R00, LXK2-PD12-S00 LXK2-PH12-R00, LXK2-PH12-S00 LXK2-PL12-P00, LXK2-PL12-Q00, LXK2-PL12-R00 Source: www.luxeon.com KINGBRIGHT: KA-3528ASYC Source: www.kingbright.com
M1 = microphon:ELECTRET_MICROPHON-: Electret Condenser Microphone
Q2 = special:XTAL"
Q3 = special:XTAL_RIGHT_GND
Q10 = TI:AO3402: N-MOS 30V logic level
Q11 = crystal:CRYSTAL: CRYSTAL; OC_FARNELL: unknown; OC_NEWARK: unknown
R2-R4 R6-R8 R11-R17 R19-R31 R33-R41 R43-R52 R54-R56 R58-R61 R63 R64 R66-R69 R72 R73 R75 R77-R93 R95 R99 R100 R119 R120 = resistor:R-EU_: RESISTOR, European symbol
R5 R18 R42 R71 R97 R102-R108 R111-R118 = rcl:R-EU_: RESISTOR, European symbol
SW1 SW2 = miscrel:TACT: SMD tactile switch, normally open
T1 T2 T5 T6 = TI:2SC3357: NPN EPITAXIAL SILICON RF TRANSISTOR FOR HIGH-FREQUENCY LOW-NOISE AMPLIFICATION 3-PIN POWER MINIMOLD
T3 T4 T9 T11 = TI:2N7002: Low quality N-MOS for logic level function Rds_on>8Ohm; 60V/3A
T7 T8 T10 T13 T16-T19 = miscrel:DMP3130L: small P-MOS SOT23-3 100mOhm rds-on
T12 = transistor-npn:BC847*: NPN Transistor
T14 T15 = TI:RQA0009SXAQS: Features High Output Power, High Gain, High Efficiency Pout = +37.8 dBm, Linear Gain = 18 dB, PAE = 65% (VDS = 6 V, f = 520 MHz) Compact package capable of surface mounting Electrostatic Discharge Immunity Test (IEC Standard, 61000-4-2, Level4)
U1 = Atmel_By_element14_Batch_1-00:ATMEGA328P-AU: 8-bit Microcontroller with In-System Programmable Flash; MPN: ATMEGA328P-AU; OC_FARNELL: 1715486; OC_NEWARK: 14R4631; PACKAGE: TQFP-32; SUPPLIER: Atmel
X1 X3 = con-coax:SMA-: SMA 50 Ohm End Launch Jack Receptacle - Round Contact Johnson Components Source: www.johnsoncomponents.com .. J502-ND.pdf; MF: JOHNSON COMPONENTS; MPN: 142-0711-821; OC_FARNELL: 1019328; OC_NEWARK: 16F3627
X2 = TI:JACK_SOCKET: PC board 3,5mm jack socket with double switch